# EAGLE design smd (EAGLE 9.6.0)
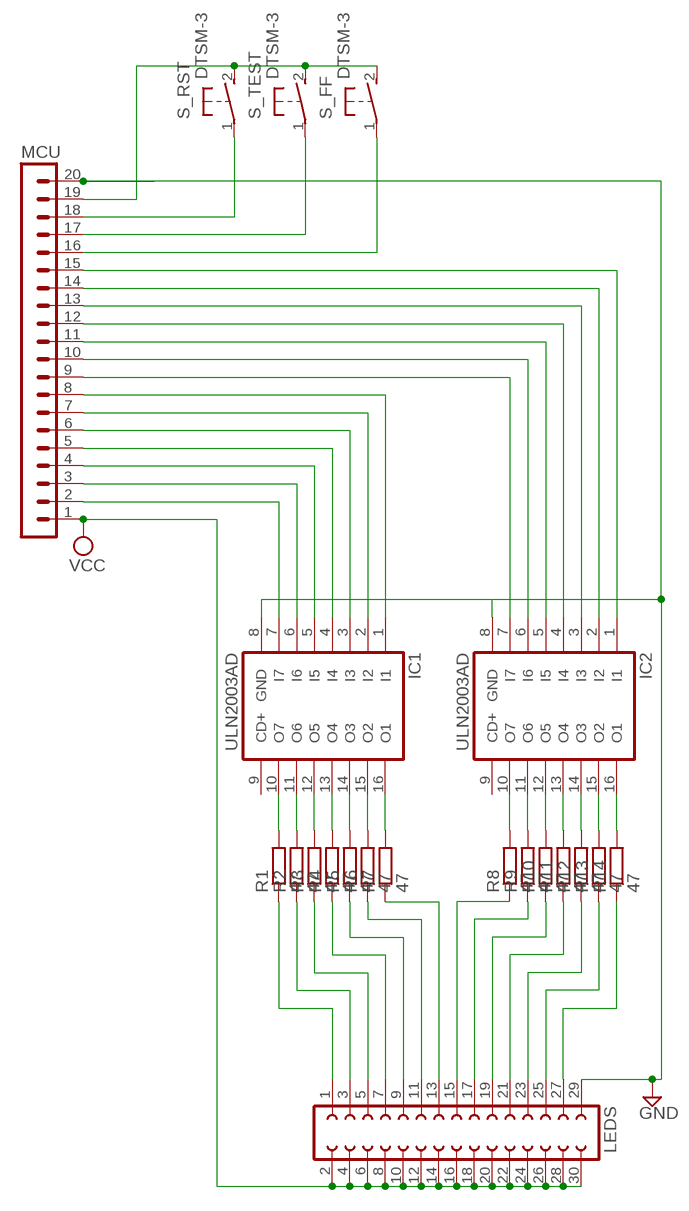
[diagram p0: schematic, sheet 1]

## Parts
IC1  ULN2003AD  [SO16]
IC2  ULN2003AD  [SO16]
LEDS  FE15-2  [FE15-2]
MCU  MA20-1  [MA20-1]
R1  47  R-EU_M0805  [M0805]
R2  47  R-EU_M0805  [M0805]
R3  47  R-EU_M0805  [M0805]
R4  47  R-EU_M0805  [M0805]
R5  47  R-EU_M0805  [M0805]
R6  47  R-EU_M0805  [M0805]
R7  47  R-EU_M0805  [M0805]
R8  47  R-EU_M0805  [M0805]
R9  47  R-EU_M0805  [M0805]
R10  47  R-EU_M0805  [M0805]
R11  47  R-EU_M0805  [M0805]
R12  47  R-EU_M0805  [M0805]
R13  47  R-EU_M0805  [M0805]
R14  47  R-EU_M0805  [M0805]
S_FF  DTSM-3  [DTSM-3]
S_RST  DTSM-3  [DTSM-3]
S_TEST  DTSM-3  [DTSM-3]

## Nets
GND: IC1.8(GND) IC2.8(GND) LEDS.29 MCU.20
N$1: IC1.1(I1) MCU.8
N$2: MCU.19 S_FF.2 S_RST.2 S_TEST.2
N$3: IC1.7(I7) MCU.2
N$4: IC1.6(I6) MCU.3
N$5: IC1.5(I5) MCU.4
N$6: IC1.4(I4) MCU.5
N$7: IC1.3(I3) MCU.6
N$8: IC1.2(I2) MCU.7
N$9: IC2.7(I7) MCU.9
N$10: IC2.6(I6) MCU.10
N$11: IC2.5(I5) MCU.11
N$12: IC2.4(I4) MCU.12
N$13: IC2.3(I3) MCU.13
N$14: IC2.2(I2) MCU.14
N$15: IC2.1(I1) MCU.15
N$17: MCU.18 S_RST.1
N$18: MCU.17 S_TEST.1
N$19: MCU.16 S_FF.1
N$20: IC1.10(O7) R1.2
N$21: IC1.11(O6) R2.2
N$22: IC1.12(O5) R3.2
N$23: IC1.13(O4) R4.2
N$24: IC1.14(O3) R5.2
N$25: IC1.15(O2) R6.2
N$26: IC1.16(O1) R7.2
N$27: IC2.10(O7) R8.2
N$28: IC2.11(O6) R9.2
N$29: IC2.12(O5) R10.2
N$30: IC2.13(O4) R11.2
N$31: IC2.14(O3) R12.2
N$32: IC2.15(O2) R13.2
N$33: IC2.16(O1) R14.2
N$34: LEDS.27 R14.1
N$35: LEDS.25 R13.1
N$36: LEDS.23 R12.1
N$37: LEDS.21 R11.1
N$38: LEDS.19 R10.1
N$39: LEDS.17 R9.1
N$40: LEDS.15 R8.1
N$41: LEDS.13 R7.1
N$42: LEDS.11 R6.1
N$43: LEDS.9 R5.1
N$44: LEDS.7 R4.1
N$45: LEDS.5 R3.1
N$46: LEDS.3 R2.1
N$47: LEDS.1 R1.1
VCC: LEDS.2 LEDS.4 LEDS.6 LEDS.8 LEDS.10 LEDS.12 LEDS.14 LEDS.16 LEDS.18 LEDS.20 LEDS.22 LEDS.24 LEDS.26 LEDS.28 LEDS.30 MCU.1
Unconnected: IC1.9(CD+) IC2.9(CD+)

## Library data of the parts
IC1 IC2 = uln-udn:ULN2003A: DRIVER ARRAY
LEDS = con-lsta:FE15-2: FEMALE HEADER; OC_FARNELL: unknown; OC_NEWARK: unknown
MCU = con-lstb:MA20-1: PIN HEADER; OC_FARNELL: unknown; OC_NEWARK: unknown
R1-R14 = rcl:R-EU_: RESISTOR, European symbol; SPICEPREFIX: R
S_FF S_RST S_TEST = switch-tact:DTSM-3

## Board
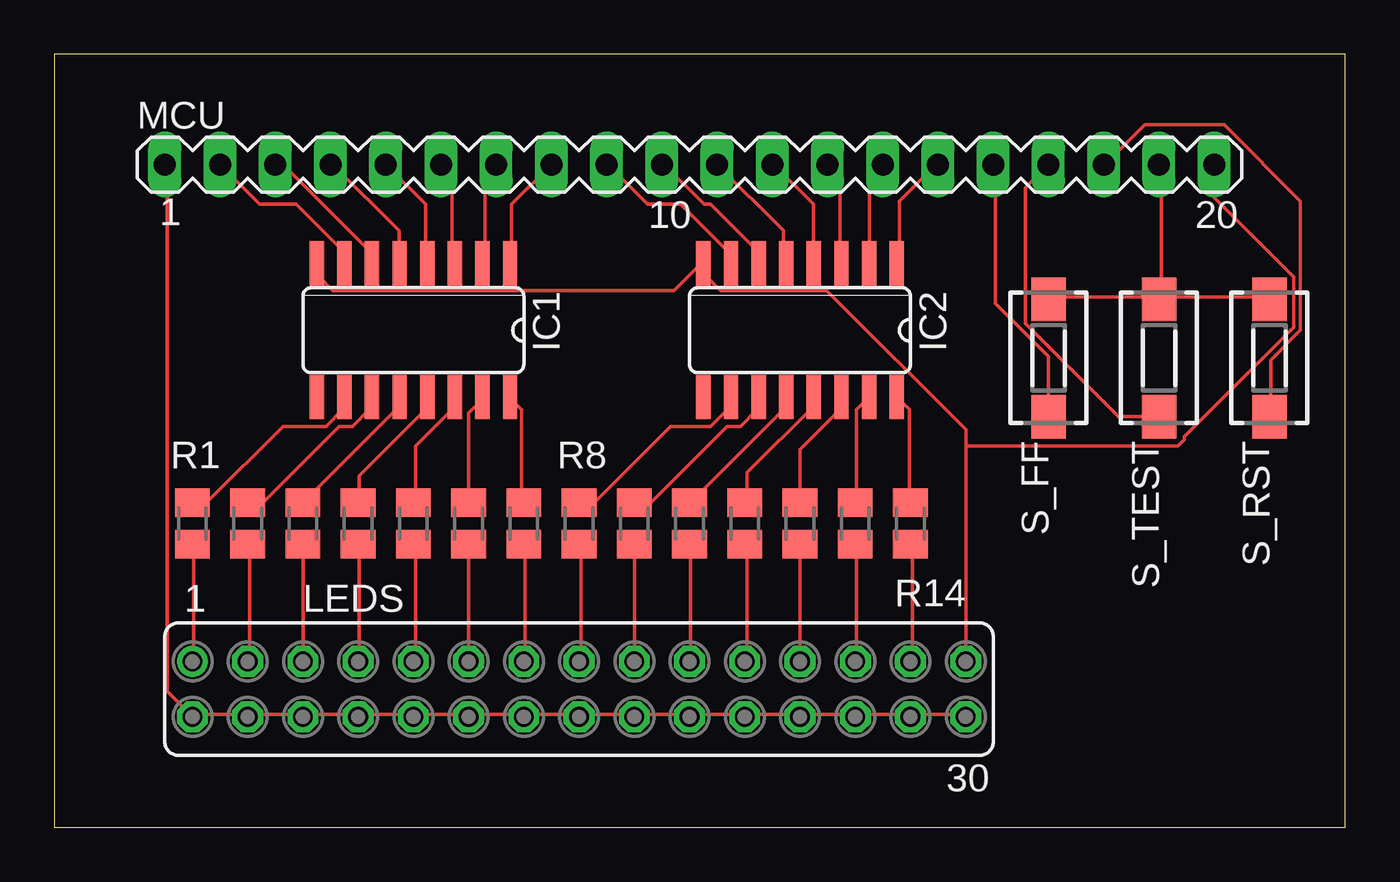
[diagram p1: board, top side]
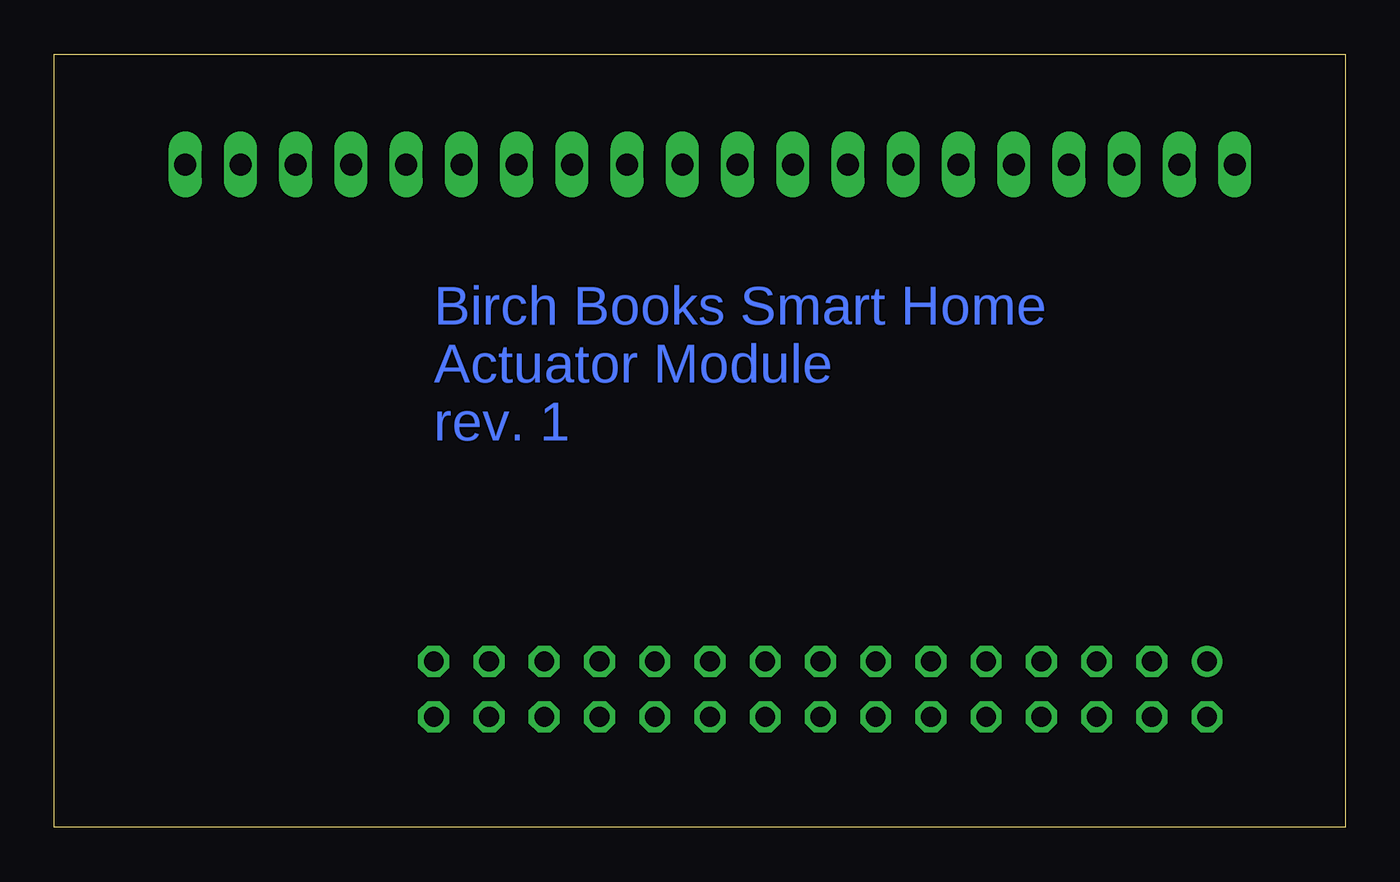
[diagram p2: board, bottom side, seen from below]

Size 59.36 x 35.55 mm. Coordinates in mm from the lower left corner, seen from the top.
Outline: 0,0 59.36,0 59.36,35.55 0,35.55 0,0
Copper layers (1*16): Top 0.035mm / dielectric 1.5mm / Bottom 0.035mm
Design rules "default": minimum track width 6mil, minimum drill 0.35mm, track to track 6mil, track to pad 6mil, pad to pad 6mil, via to via 6mil, smd to smd 6mil, copper to edge 40mil, drill to drill 6mil, minimum pad ring 10mil, minimum via ring 8mil, stop-mask expansion 4mil, vias tented up to drill 0mil, thermal gap 10mil

### Footprints (pad centres in the part's own frame; a part is rotated, then mirrored left to right if it is on the bottom)
SO16 = smd 0.66 x 2.032: 1 -4.445,-3.073; 2 -3.175,-3.073; 3 -1.905,-3.073; 4 -0.635,-3.073; 5 0.635,-3.073; 6 1.905,-3.073; 7 3.175,-3.073; 8 4.445,-3.073; 9 4.445,3.073; 10 3.175,3.073; 11 1.905,3.073; 12 0.635,3.073; 13 -0.635,3.073; 14 -1.905,3.073; 15 -3.175,3.073; 16 -4.445,3.073
FE15-2 = drill 0.914: 1 -17.78,1.27 | drill 0.914 octagon: 2 -17.78,-1.27; 3 -15.24,1.27; 4 -15.24,-1.27; 5 -12.7,1.27; 6 -12.7,-1.27; 7 -10.16,1.27; 8 -10.16,-1.27; 9 -7.62,1.27; 10 -7.62,-1.27; 11 -5.08,1.27; 12 -5.08,-1.27; 13 -2.54,1.27; 14 -2.54,-1.27; 15 0,1.27; 16 0,-1.27; 17 2.54,1.27; 18 2.54,-1.27; 19 5.08,1.27; 20 5.08,-1.27; 21 7.62,1.27; 22 7.62,-1.27; 23 10.16,1.27; 24 10.16,-1.27; 25 12.7,1.27; 26 12.7,-1.27; 27 15.24,1.27; 28 15.24,-1.27; 29 17.78,1.27; 30 17.78,-1.27
MA20-1 = drill 1.016 long: 1 -24.13,0; 2 -21.59,0; 3 -19.05,0; 4 -16.51,0; 5 -13.97,0; 6 -11.43,0; 7 -8.89,0; 8 -6.35,0; 9 -3.81,0; 10 -1.27,0; 11 1.27,0; 12 3.81,0; 13 6.35,0; 14 8.89,0; 15 11.43,0; 16 13.97,0; 17 16.51,0; 18 19.05,0; 19 21.59,0; 20 24.13,0
M0805 = smd 1.3 x 1.6: 1 -0.95,0; 2 0.95,0
DTSM-3 = smd 2 x 1.6: 1 -2.7,0; 2 2.7,0

### Placement (x,y rotation side)
IC1  16.51,22.86 180 top
IC2  34.29,22.86 180 top
LEDS  24.13,6.35 0 top
MCU  29.21,30.48 0 top
R1  6.35,13.97 90 top
R2  8.89,13.97 90 top
R3  11.43,13.97 90 top
R4  13.97,13.97 90 top
R5  16.51,13.97 90 top
R6  19.05,13.97 90 top
R7  21.59,13.97 90 top
R8  24.13,13.97 90 top
R9  26.67,13.97 90 top
R10  29.21,13.97 90 top
R11  31.75,13.97 90 top
R12  34.29,13.97 90 top
R13  36.83,13.97 90 top
R14  39.37,13.97 90 top
S_FF  45.72,21.59 90 top
S_RST  55.88,21.59 90 top
S_TEST  50.8,21.59 90 top

### Tracks (layer width: path | path; a pad name or v marks a point on that pad's centre or on a via)
GND
  Top 0.152: 29.57,25.76 29.72,25.91 IC2.8 29.57,25.76 | 29.57,25.76 28.5,24.69 12.8,24.69 12.19,25.3 12.19,25.91 IC1.8 | 41.91,17.53 41.91,18.29 35.51,24.69 30.63,24.69 29.57,25.76 | 41.91,17.53 LEDS.29 | MCU.20 53.34,28.96 57,25.3 57,23.01 51.97,17.98 51.97,17.83 51.66,17.53 41.91,17.53
N$1
  Top 0.152: MCU.8 21.03,28.65 21.03,26.06 IC1.1
N$2
  Top 0.152: S_FF.2 45.72,24.38 50.75,24.38 S_TEST.2 50.9,24.38 | 50.9,24.38 55.78,24.38 S_RST.2 | 50.9,24.38 50.9,30.48 MCU.19
N$3
  Top 0.152: MCU.2 9.45,28.65 11.12,28.65 13.26,26.52 13.26,26.06 IC1.7
N$4
  Top 0.152: MCU.3 10.52,30.48 14.48,26.52 14.48,26.06 IC1.6
N$5
  Top 0.152: IC1.5 15.85,26.06 15.85,27.43 12.8,30.48 MCU.4
N$6
  Top 0.152: MCU.5 17.07,28.65 17.07,26.06 IC1.4
N$7
  Top 0.152: IC1.3 18.29,26.06 18.29,30.02 17.83,30.48 MCU.6
N$8
  Top 0.152: IC1.2 19.81,26.06 19.81,30.02 20.27,30.48 MCU.7
N$9
  Top 0.152: IC2.7 31.09,26.06 31.09,26.36 28.8,28.65 27.28,28.65 25.45,30.48 MCU.9
N$10
  Top 0.152: IC2.6 32.31,26.06 32.31,26.52 30.18,28.65 29.87,28.65 28.04,30.48 MCU.10
N$11
  Top 0.152: MCU.11 33.53,27.43 33.53,26.06 IC2.5
N$12
  Top 0.152: IC2.4 34.9,26.06 34.9,28.65 33.07,30.48 MCU.12
N$13
  Top 0.152: IC2.3 36.12,26.06 36.12,30.02 35.66,30.48 MCU.13
N$14
  Top 0.152: MCU.14 37.49,29.87 37.49,26.06 IC2.2
N$15
  Top 0.152: IC2.1 38.86,26.06 38.86,28.8 40.54,30.48 MCU.15
N$17
  Top 0.152: S_RST.1 55.93,18.9 55.93,21.49 57.3,22.86 57.3,28.8 53.8,32.31 50.14,32.31 48.31,30.48 MCU.18
N$18
  Top 0.152: MCU.17 44.65,29.41 44.65,23.16 48.92,18.9 50.75,18.9 S_TEST.1
N$19
  Top 0.152: S_FF.1 45.72,21.64 43.28,24.08 43.28,30.48 MCU.16
N$20
  Top 0.152: R1.2 6.4,14.94 7.01,14.94 10.52,18.44 12.5,18.44 13.26,19.2 13.26,19.66 IC1.10
N$21
  Top 0.152: R2.2 8.99,14.94 9.6,14.94 13.11,18.44 13.72,18.44 14.48,19.2 14.48,19.66 IC1.11
N$22
  Top 0.152: R3.2 11.43,14.94 15.85,19.36 15.85,19.66 IC1.12
N$23
  Top 0.152: R4.2 14.02,14.94 14.02,16.15 17.07,19.2 17.07,19.66 IC1.13
N$24
  Top 0.152: R5.2 16.61,14.94 16.61,17.53 18.29,19.2 18.29,19.66 IC1.14
N$25
  Top 0.152: R6.2 19.05,19.05 19.66,19.66 IC1.15
N$26
  Top 0.152: R7.2 21.49,14.94 21.49,19.2 21.03,19.66 IC1.16
N$27
  Top 0.152: R8.2 24.23,14.94 24.84,14.94 28.35,18.44 30.18,18.44 31.09,19.36 31.09,19.66 IC2.10
N$28
  Top 0.152: R9.2 26.67,14.94 27.43,14.94 30.94,18.44 31.55,18.44 32.31,19.2 32.31,19.66 IC2.11
N$29
  Top 0.152: R10.2 29.26,14.94 33.53,19.2 33.53,19.66 IC2.12
N$30
  Top 0.152: R11.2 31.85,14.94 31.85,16.31 34.9,19.36 34.9,19.66 IC2.13
N$31
  Top 0.152: R12.2 34.29,17.37 36.12,19.2 36.12,19.66 IC2.14
N$32
  Top 0.152: IC2.15 36.88,19.2 36.88,14.94 R13.2
N$33
  Top 0.152: IC2.16 39.32,19.2 39.32,14.94 R14.2
N$34
  Top 0.152: R14.1 39.47,12.95 39.47,7.62 LEDS.27
N$35
  Top 0.152: R13.1 36.88,12.95 36.88,7.62 LEDS.25
N$36
  Top 0.152: LEDS.23 R12.1
N$37
  Top 0.152: R11.1 31.85,12.95 31.85,7.62 LEDS.21
N$38
  Top 0.152: R10.1 29.26,12.95 29.26,7.62 LEDS.19
N$39
  Top 0.152: LEDS.17 R9.1
N$40
  Top 0.152: R8.1 24.23,12.95 24.23,7.62 LEDS.15
N$41
  Top 0.152: R7.1 21.64,12.95 21.64,7.62 LEDS.13
N$42
  Top 0.152: LEDS.11 R6.1
N$43
  Top 0.152: R5.1 16.61,12.95 16.61,7.62 LEDS.9
N$44
  Top 0.152: R4.1 14.02,12.95 14.02,7.62 LEDS.7
N$45
  Top 0.152: LEDS.5 R3.1
N$46
  Top 0.152: R2.1 8.99,12.95 8.99,7.62 LEDS.3
N$47
  Top 0.152: R1.1 6.4,12.95 6.4,7.62 LEDS.1
VCC
  Top 0.152: 34.29,5.18 31.85,5.18 LEDS.22 31.7,5.18 29.26,5.18 LEDS.20 29.11,5.18 26.67,5.18 | LEDS.30 41.91,5.18 39.47,5.18 LEDS.28 39.32,5.18 36.88,5.18 LEDS.26 36.73,5.18 34.29,5.18 | 34.29,5.18 LEDS.24 | 19.05,5.18 16.61,5.18 LEDS.10 16.46,5.18 14.02,5.18 LEDS.8 13.87,5.18 11.43,5.18 | 26.67,5.18 24.23,5.18 LEDS.16 24.08,5.18 21.64,5.18 LEDS.14 21.49,5.18 19.05,5.18 | 19.05,5.18 LEDS.12 | 11.43,5.18 8.99,5.18 LEDS.4 8.84,5.18 6.4,5.18 LEDS.2 5.18,6.25 5.18,30.48 MCU.1 | 11.43,5.18 LEDS.6 | 26.67,5.18 LEDS.18

### Text on the board
Bottom: Birch Books Smart Home / Actuator Module / rev. 1